# EAGLE schematic buff_statue (EAGLE 9.6.2)
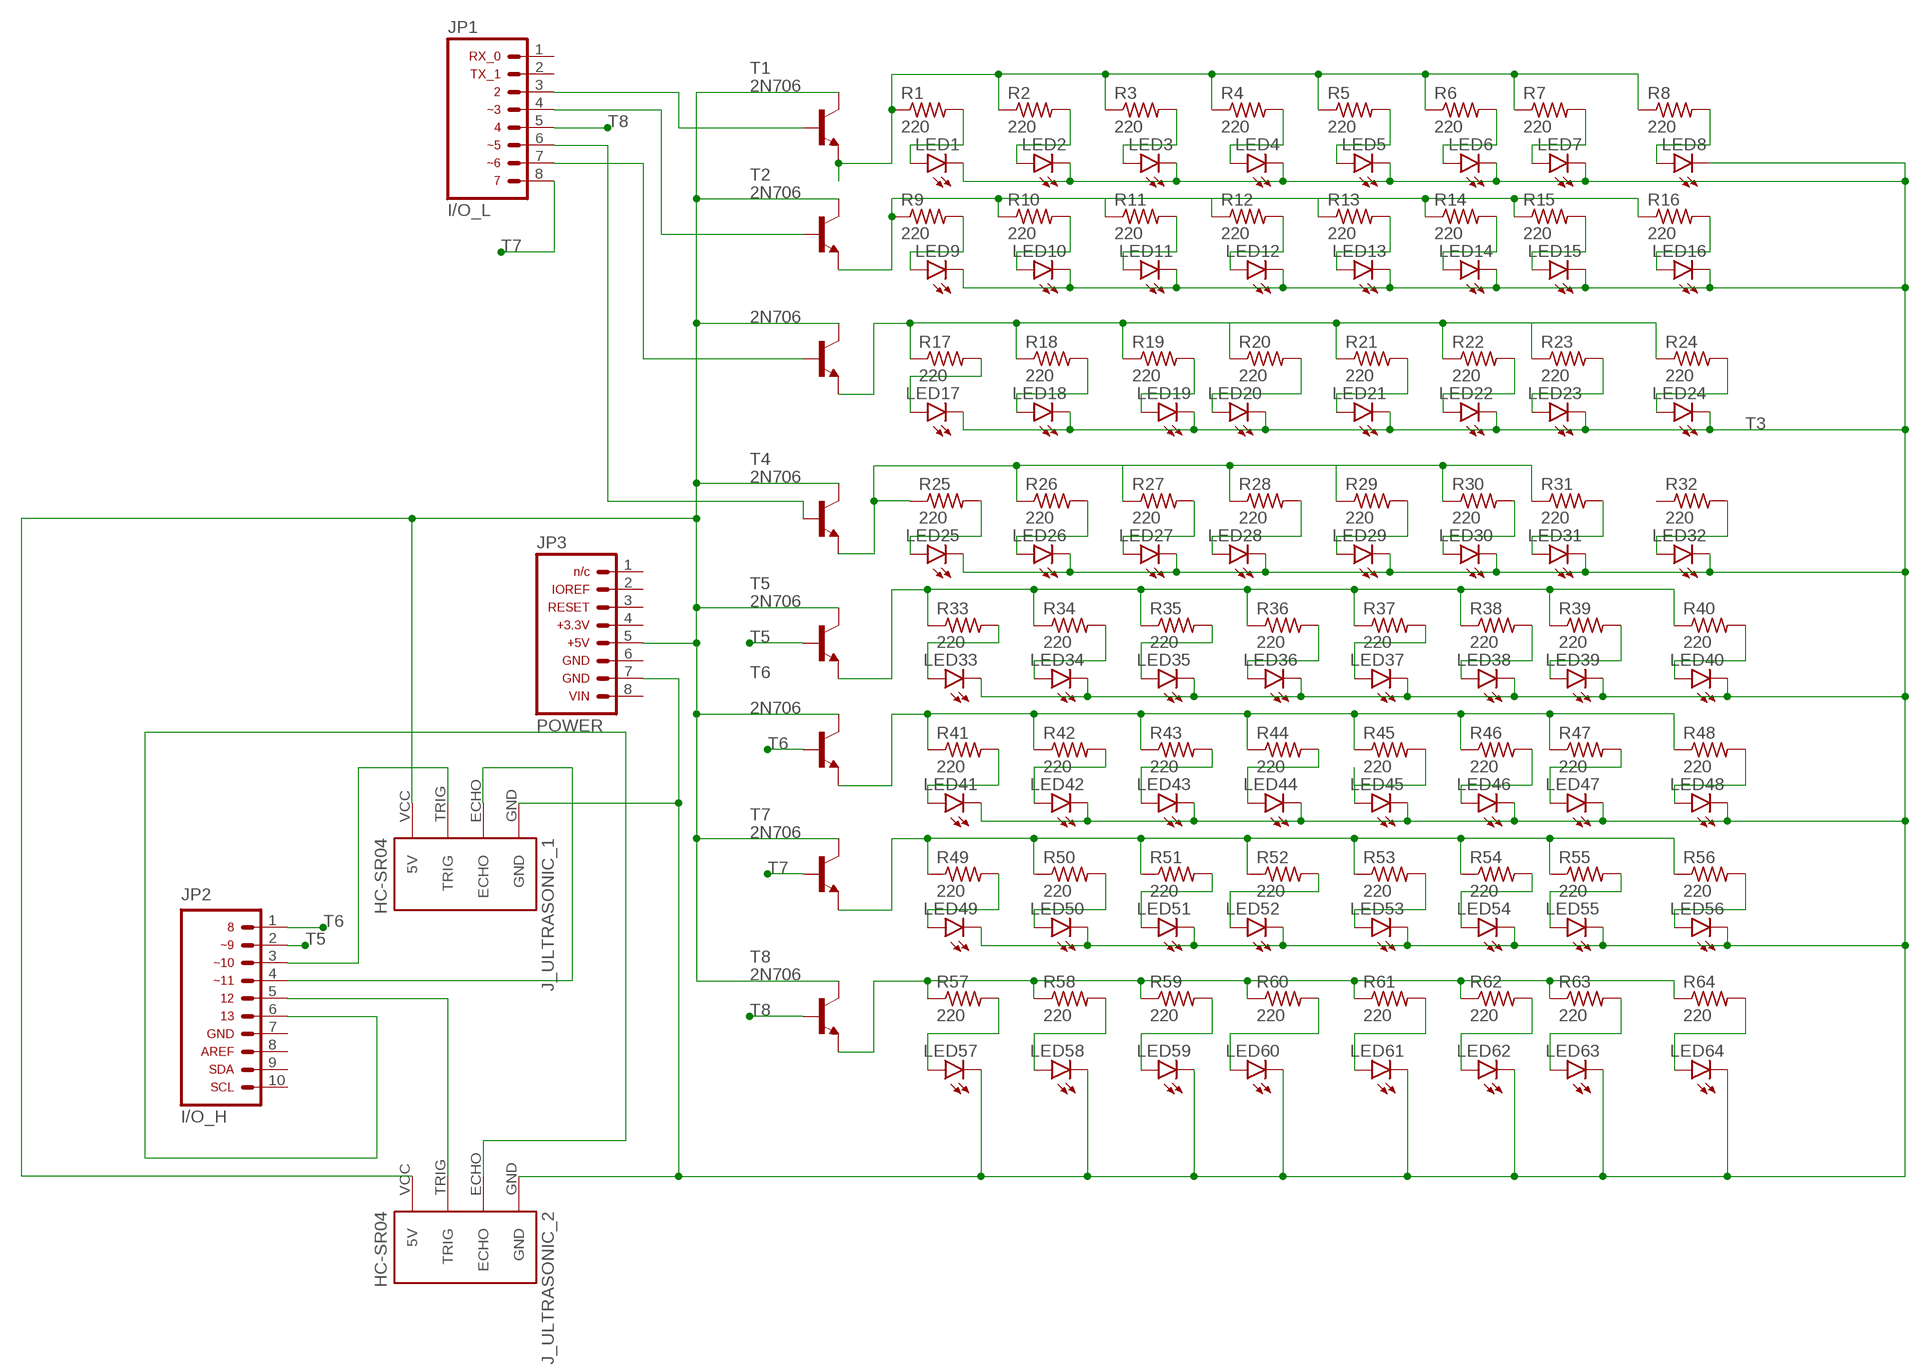
[diagram p0: schematic, sheet 1]

## Parts
J_ULTRASONIC_1  HC-SR04  [HC-SR04_FOOTPRINT]
J_ULTRASONIC_2  HC-SR04  [HC-SR04_FOOTPRINT]
JP1  ARDUINO_CONN-IO_LSIP  [CONN-1X08]
JP2  ARDUINO_CONN-IO_HSIP  [CONN-1X10]
JP3  ARDUINO_CONN-POWERSIP  [CONN-1X08]
LED1  LED5MM  [LED5MM]
LED2  LED5MM  [LED5MM]
LED3  LED5MM  [LED5MM]
LED4  LED5MM  [LED5MM]
LED5  LED5MM  [LED5MM]
LED6  LED5MM  [LED5MM]
LED7  LED5MM  [LED5MM]
LED8  LED5MM  [LED5MM]
LED9  LED5MM  [LED5MM]
LED10  LED5MM  [LED5MM]
LED11  LED5MM  [LED5MM]
LED12  LED5MM  [LED5MM]
LED13  LED5MM  [LED5MM]
LED14  LED5MM  [LED5MM]
LED15  LED5MM  [LED5MM]
LED16  LED5MM  [LED5MM]
LED17  LED5MM  [LED5MM]
LED18  LED5MM  [LED5MM]
LED19  LED5MM  [LED5MM]
LED20  LED5MM  [LED5MM]
LED21  LED5MM  [LED5MM]
LED22  LED5MM  [LED5MM]
LED23  LED5MM  [LED5MM]
LED24  LED5MM  [LED5MM]
LED25  LED5MM  [LED5MM]
LED26  LED5MM  [LED5MM]
LED27  LED5MM  [LED5MM]
LED28  LED5MM  [LED5MM]
LED29  LED5MM  [LED5MM]
LED30  LED5MM  [LED5MM]
LED31  LED5MM  [LED5MM]
LED32  LED5MM  [LED5MM]
LED33  LED5MM  [LED5MM]
LED34  LED5MM  [LED5MM]
LED35  LED5MM  [LED5MM]
LED36  LED5MM  [LED5MM]
LED37  LED5MM  [LED5MM]
LED38  LED5MM  [LED5MM]
LED39  LED5MM  [LED5MM]
LED40  LED5MM  [LED5MM]
LED41  LED5MM  [LED5MM]
LED42  LED5MM  [LED5MM]
LED43  LED5MM  [LED5MM]
LED44  LED5MM  [LED5MM]
LED45  LED5MM  [LED5MM]
LED46  LED5MM  [LED5MM]
LED47  LED5MM  [LED5MM]
LED48  LED5MM  [LED5MM]
LED49  LED5MM  [LED5MM]
LED50  LED5MM  [LED5MM]
LED51  LED5MM  [LED5MM]
LED52  LED5MM  [LED5MM]
LED53  LED5MM  [LED5MM]
LED54  LED5MM  [LED5MM]
LED55  LED5MM  [LED5MM]
LED56  LED5MM  [LED5MM]
LED57  LED5MM  [LED5MM]
LED58  LED5MM  [LED5MM]
LED59  LED5MM  [LED5MM]
LED60  LED5MM  [LED5MM]
LED61  LED5MM  [LED5MM]
LED62  LED5MM  [LED5MM]
LED63  LED5MM  [LED5MM]
LED64  LED5MM  [LED5MM]
R1  220  R-US_0204/7  [0204/7]
R2  220  R-US_0204/7  [0204/7]
R3  220  R-US_0204/7  [0204/7]
R4  220  R-US_0204/7  [0204/7]
R5  220  R-US_0204/7  [0204/7]
R6  220  R-US_0204/7  [0204/7]
R7  220  R-US_0204/7  [0204/7]
R8  220  R-US_0204/7  [0204/7]
R9  220  R-US_0204/7  [0204/7]
R10  220  R-US_0204/7  [0204/7]
R11  220  R-US_0204/7  [0204/7]
R12  220  R-US_0204/7  [0204/7]
R13  220  R-US_0204/7  [0204/7]
R14  220  R-US_0204/7  [0204/7]
R15  220  R-US_0204/7  [0204/7]
R16  220  R-US_0204/7  [0204/7]
R17  220  R-US_0204/7  [0204/7]
R18  220  R-US_0204/7  [0204/7]
R19  220  R-US_0204/7  [0204/7]
R20  220  R-US_0204/7  [0204/7]
R21  220  R-US_0204/7  [0204/7]
R22  220  R-US_0204/7  [0204/7]
R23  220  R-US_0204/7  [0204/7]
R24  220  R-US_0204/7  [0204/7]
R25  220  R-US_0204/7  [0204/7]
R26  220  R-US_0204/7  [0204/7]
R27  220  R-US_0204/7  [0204/7]
R28  220  R-US_0204/7  [0204/7]
R29  220  R-US_0204/7  [0204/7]
R30  220  R-US_0204/7  [0204/7]
R31  220  R-US_0204/7  [0204/7]
R32  220  R-US_0204/7  [0204/7]
R33  220  R-US_0204/7  [0204/7]
R34  220  R-US_0204/7  [0204/7]
R35  220  R-US_0204/7  [0204/7]
R36  220  R-US_0204/7  [0204/7]
R37  220  R-US_0204/7  [0204/7]
R38  220  R-US_0204/7  [0204/7]
R39  220  R-US_0204/7  [0204/7]
R40  220  R-US_0204/7  [0204/7]
R41  220  R-US_0204/7  [0204/7]
R42  220  R-US_0204/7  [0204/7]
R43  220  R-US_0204/7  [0204/7]
R44  220  R-US_0204/7  [0204/7]
R45  220  R-US_0204/7  [0204/7]
R46  220  R-US_0204/7  [0204/7]
R47  220  R-US_0204/7  [0204/7]
R48  220  R-US_0204/7  [0204/7]
R49  220  R-US_0204/7  [0204/7]
R50  220  R-US_0204/7  [0204/7]
R51  220  R-US_0204/7  [0204/7]
R52  220  R-US_0204/7  [0204/7]
R53  220  R-US_0204/7  [0204/7]
R54  220  R-US_0204/7  [0204/7]
R55  220  R-US_0204/7  [0204/7]
R56  220  R-US_0204/7  [0204/7]
R57  220  R-US_0204/7  [0204/7]
R58  220  R-US_0204/7  [0204/7]
R59  220  R-US_0204/7  [0204/7]
R60  220  R-US_0204/7  [0204/7]
R61  220  R-US_0204/7  [0204/7]
R62  220  R-US_0204/7  [0204/7]
R63  220  R-US_0204/7  [0204/7]
R64  220  R-US_0204/7  [0204/7]
T1  2N706  [TO18]
T2  2N706  [TO18]
T3  2N706  [TO18]
T4  2N706  [TO18]
T5  2N706  [TO18]
T6  2N706  [TO18]
T7  2N706  [TO18]
T8  2N706  [TO18]

## Nets
N$1: J_ULTRASONIC_1.VCC(5V) J_ULTRASONIC_2.VCC(5V) JP3.5 T1.3(C) T2.3(C) T3.3(C) T4.3(C) T5.3(C) T6.3(C) T7.3(C) T8.3(C)
N$2: R1.1 R2.1 R3.1 R4.1 R5.1 R6.1 R7.1 R8.1 T1.1(E)
N$3: LED57.A R57.2
N$4: LED58.A R58.2
N$5: LED59.A R59.2
N$6: LED60.A R60.2
N$7: LED61.A R61.2
N$8: LED62.A R62.2
N$9: LED63.A R63.2
N$10: LED64.A R64.2
N$11: LED49.A R49.2
N$12: LED50.A R50.2
N$13: LED51.A R51.2
N$14: LED52.A R52.2
N$15: LED53.A R53.2
N$16: LED54.A R54.2
N$17: LED55.A R55.2
N$18: LED56.A R56.2
N$19: LED41.A R41.2
N$20: LED42.A R42.2
N$21: LED43.A R43.2
N$22: LED44.A R44.2
N$23: LED45.A R45.2
N$24: LED46.A R46.2
N$25: LED47.A R47.2
N$26: LED48.A R48.2
N$27: LED33.A R33.2
N$28: LED34.A R34.2
N$29: LED35.A R35.2
N$30: LED36.A R36.2
N$31: LED37.A R37.2
N$32: LED38.A R38.2
N$33: LED39.A R39.2
N$34: LED40.A R40.2
N$35: LED25.A R25.2
N$36: LED26.A R26.2
N$37: LED27.A R27.2
N$38: LED28.A R28.2
N$39: LED29.A R29.2
N$40: LED30.A R30.2
N$41: LED31.A R31.2
N$42: LED32.A R32.2
N$43: LED17.A R17.2
N$44: LED18.A R18.2
N$45: LED19.A R19.2
N$46: LED20.A R20.2
N$47: LED21.A R21.2
N$48: LED22.A R22.2
N$49: LED23.A R23.2
N$50: LED24.A R24.2
N$51: LED9.A R9.2
N$52: LED10.A R10.2
N$53: LED11.A R11.2
N$54: LED12.A R12.2
N$55: LED13.A R13.2
N$56: LED14.A R14.2
N$57: LED15.A R15.2
N$58: LED16.A R16.2
N$59: LED1.A R1.2
N$60: LED2.A R2.2
N$61: LED3.A R3.2
N$62: LED4.A R4.2
N$63: LED5.A R5.2
N$64: LED6.A R6.2
N$65: LED7.A R7.2
N$66: LED8.A R8.2
N$67: R9.1 R10.1 R11.1 R12.1 R13.1 R14.1 R15.1 R16.1 T2.1(E)
N$68: R17.1 R18.1 R19.1 R20.1 R21.1 R22.1 R23.1 R24.1 T3.1(E)
N$69: R57.1 R58.1 R59.1 R60.1 R61.1 R62.1 R63.1 R64.1 T8.1(E)
N$70: R25.1 R26.1 R27.1 R28.1 R29.1 R30.1 R31.1 T4.1(E)
N$71: R33.1 R34.1 R35.1 R36.1 R37.1 R38.1 R39.1 R40.1 T5.1(E)
N$72: J_ULTRASONIC_1.GND J_ULTRASONIC_2.GND JP3.7 LED1.K(C) LED2.K(C) LED3.K(C) LED4.K(C) LED5.K(C) LED6.K(C) LED7.K(C) LED8.K(C) LED9.K(C) LED10.K(C) LED11.K(C) LED12.K(C) LED13.K(C) LED14.K(C) LED15.K(C) LED16.K(C) LED17.K(C) LED18.K(C) LED19.K(C) LED20.K(C) LED21.K(C) LED22.K(C) LED23.K(C) LED24.K(C) LED25.K(C) LED26.K(C) LED27.K(C) LED28.K(C) LED29.K(C) LED30.K(C) LED31.K(C) LED32.K(C) LED33.K(C) LED34.K(C) LED35.K(C) LED36.K(C) LED37.K(C) LED38.K(C) LED39.K(C) LED40.K(C) LED41.K(C) LED42.K(C) LED43.K(C) LED44.K(C) LED45.K(C) LED46.K(C) LED47.K(C) LED48.K(C) LED49.K(C) LED50.K(C) LED51.K(C) LED52.K(C) LED53.K(C) LED54.K(C) LED55.K(C) LED56.K(C) LED57.K(C) LED58.K(C) LED59.K(C) LED60.K(C) LED61.K(C) LED62.K(C) LED63.K(C) LED64.K(C)
N$73: J_ULTRASONIC_2.TRIG JP2.5
N$74: R41.1 R42.1 R43.1 R44.1 R45.1 R46.1 R47.1 R48.1 T6.1(E)
N$75: R49.1 R50.1 R51.1 R52.1 R53.1 R54.1 R55.1 R56.1 T7.1(E)
N$76: J_ULTRASONIC_2.ECHO JP2.6
N$77: J_ULTRASONIC_1.ECHO JP2.4
N$78: J_ULTRASONIC_1.TRIG JP2.3
N$79: JP1.3 T1.2(B)
N$80: JP1.4 T2.2(B)
N$81: JP1.7 T3.2(B)
N$82: JP1.6 T4.2(B)
T5: JP2.2 T5.2(B)
T6: JP2.1 T6.2(B)
T7: JP1.8 T7.2(B)
T8: JP1.5 T8.2(B)
Unconnected: JP1.1 JP1.2 JP2.7 JP2.8 JP2.9 JP2.10 JP3.1 JP3.2 JP3.3 JP3.4 JP3.6 JP3.8 R32.1

## Library data of the parts
J_ULTRASONIC_1 J_ULTRASONIC_2 = Ultrasonic Sensor HC-SR04:HC-SR04: Ultrasonic Sensor HC-SR04
JP1 = arduino_jw:ARDUINO_CONN-IO_L: Arduino Digital I/O [Low Byte] Header This is the Digital I/O [low byte] header on the Arduino Uno R3. This connector is labeled with the following pin assignments: Digital 0, Serial Rx Digital 1, Serial Tx Digital 2 Digital 4 Digital 5 [PWM] Digital 6 [PWM] Digital 7 NOTE: Be sure you install this connector with the correct orientation on your PCB layout. Pin 1 has a square pad to assist with orientation.
JP2 = arduino_jw:ARDUINO_CONN-IO_H: Arduino Digital I/O [High Byte] Header This is the Digital I/O [high byte] header on the Arduino Uno R3. This connector is labeled with the following pin assignments: Digital 8 Digital 9 [PWM] Digital 10 [PWM] Digital 11 [PWM] Digital 12 Digital 13 GND AREF SDA SCL NOTE: Be sure you install this connector with the correct orientation on your PCB layout. Pin 1 has a square pad to assist with orientation.
JP3 = arduino_jw:ARDUINO_CONN-POWER: Arduino Power Header This is the power header on the Arduino Uno R3. This connector is labeled with the following pin assignments: n/c IO Ref RESET +3.3V +5V GND GND VIN NOTE: Be sure you install this connector with the correct orientation on your PCB layout. Pin 1 has a square pad to assist with orientation.
LED1-LED64 = led:LED: LED OSRAM: - CHIPLED LG R971, LG N971, LY N971, LG Q971, LY Q971, LO R971, LY R971 LH N974, LH R974 LS Q976, LO Q976, LY Q976 LO Q996 - Hyper CHIPLED LW Q18S LB Q993, LB Q99A, LB R99A - SideLED LS A670, LO A670, LY A670, LG A670, LP A670 LB A673, LV A673, LT A673, LW A673 LH A674 LY A675 LS A676, LA A676, LO A676, LY A676, LW A676 LS A679, LY A679, LG A679 - Hyper Micro SIDELED® LS Y876, LA Y876, LO Y876, LY Y876 LT Y87S - SmartLED LW L88C, LW L88S LB L89C, LB L89S, LG L890 LS L89K, LO L89K, LY L89K LS L896, LA L896, LO L896, LY L896 - TOPLED LS T670, LO T670, LY T670, LG T670, LP T670 LSG T670, LSP T670, LSY T670, LOP T670, LYG T670 LG T671, LOG T671, LSG T671 LB T673, LV T673, LT T673, LW T673 LH T674 LS T676, LA T676, LO T676, LY T676, LB T676, LH T676, LSB T676, LW T676 LB T67C, LV T67C, LT T67C, LS T67K, LO T67K, LY T67K, LW E67C LS E67B, LA E67B, LO E67B, LY E67B, LB E67C, LV E67C, LT E67C LW T67C LS T679, LY T679, LG T679 LS T770, LO T770, LY T770, LG T770, LP T770 LB T773, LV T773, LT T773, LW T773 LH T774 LS E675, LA E675, LY E675, LS T675 LS T776, LA T776, LO T776, LY T776, LB T776 LHGB T686 LT T68C, LB T68C - Hyper Mini TOPLED® LB M676 - Mini TOPLED Santana® LG M470 LS M47K, LO M47K, LY M47K Source: http://www.osram.convergy.de LUXEON: - LUMILED® LXK2-PW12-R00, LXK2-PW12-S00, LXK2-PW14-U00, LXK2-PW14-V00 LXK2-PM12-R00, LXK2-PM12-S00, LXK2-PM14-U00 LXK2-PE12-Q00, LXK2-PE12-R00, LXK2-PE12-S00, LXK2-PE14-T00, LXK2-PE14-U00 LXK2-PB12-K00, LXK2-PB12-L00, LXK2-PB12-M00, LXK2-PB14-N00, LXK2-PB14-P00, LXK2-PB14-Q00 LXK2-PR12-L00, LXK2-PR12-M00, LXK2-PR14-Q00, LXK2-PR14-R00 LXK2-PD12-Q00, LXK2-PD12-R00, LXK2-PD12-S00 LXK2-PH12-R00, LXK2-PH12-S00 LXK2-PL12-P00, LXK2-PL12-Q00, LXK2-PL12-R00 Source: www.luxeon.com KINGBRIGHT: KA-3528ASYC Source: www.kingbright.com
R1-R64 = rcl:R-US_: RESISTOR, American symbol; SPICEPREFIX: R
T1-T8 = transistor:2N706: NPN TRANSISTOR